# EAGLE design STM32L010F4P6 (EAGLE 9.6.0)
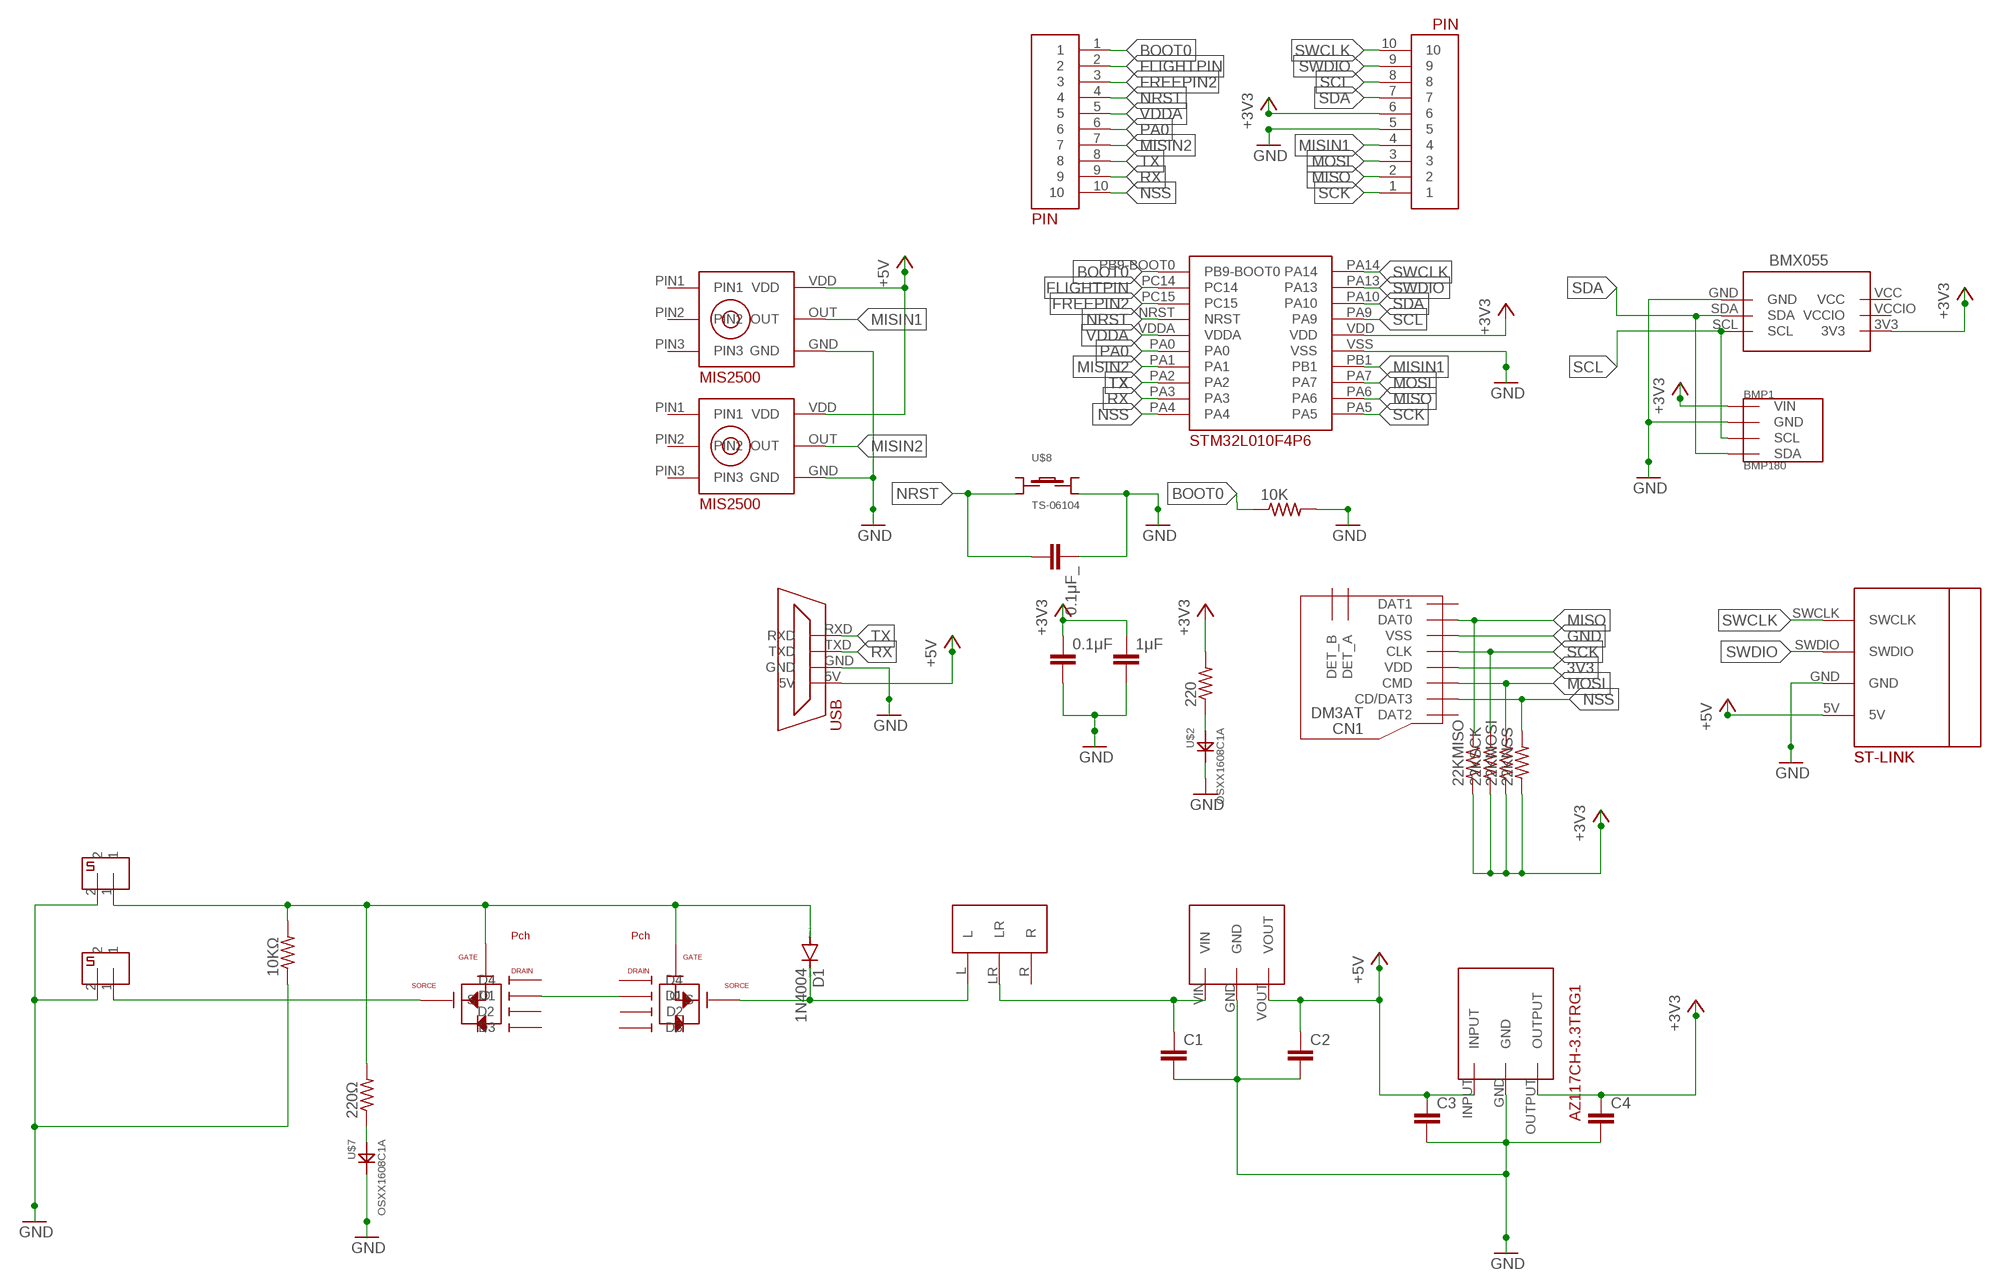
[diagram p0: schematic, sheet 1]

## Parts
0.1μF  C-EUC0603  [C0603]
0.1μF_  C-EUC0603  [C0603]
1μF  C-EUC0805  [C0805]
10K  R-US_R0603  [R0603]
10KΩ  R-US_R0603  [R0603]
22KMISO  R-US_R0603  [R0603]
22KMOSI  R-US_R0603  [R0603]
22KNSS  R-US_R0603  [R0603]
22KSCK  R-US_R0603  [R0603]
220  R-US_R0603  [R0603]
220Ω  R-US_R0603  [R0603]
BMP1  BMP180  [GY-68]
BMX1  BMX055  [BMX055]
C1  C2,5-3  [C2.5-3]
C2  C2,5-3  [C2.5-3]
C3  C2,5-3  [C2.5-3]
C4  C2,5-3  [C2.5-3]
CN1  DM3AT  [DM3AT]
CONNECTOR1  2PIN  [2PIN]
CONNECTOR3  2PIN  [2PIN]
D1  1N4004  [DO41-10]
SRIDE_SWTCH1  SRIDE_SWITCH  [SRIDE_SWITCH]
U$1  STM32L010F4P6  [STM32L010F4P6]
U$2  OSXX1608C1A  [OSXX1608C1A]
U$3  MIS2500  [MIS2500]
U$4  MIS2500  [MIS2500]
U$5  STLINK  [STLINK]
U$6  SSM6J808R  [SSM6J808R]
U$7  OSXX1608C1A  [OSXX1608C1A]
U$8  TS-06104  [TS-06104]
U$9  SSM6J808R  [SSM6J808R]
U$11  M78AR05-1  [M78AR05-1]
U$12  10PIN  [10PIN]
U$13  10PIN  [10PIN]
U$14  F234X  [FT234X]
U$17  AZ117CH-3.3TRG1  [AZ117CH-3.3TRG1]

## Nets
3V3: CN1.VDD
+3V3: 0.1μF.1 1μF.1 22KMISO.1 22KMOSI.1 22KNSS.1 22KSCK.1 220.2 BMP1.P1(VIN) BMX1.3V3 C4.1 U$1.VDD U$13.6 U$17.OUTPUT
+5V: C2.1 C3.1 U$3.VDD U$4.VDD U$5.5V U$11.VOUT U$14.5V U$17.INPUT
BOOT0: 10K.1 U$1.PB9-BOOT0 U$12.1
EXIN: 10KΩ.2 220Ω.2 CONNECTOR1.1 D1.A U$6.G U$9.G
FLIGHTPIN: U$1.PC14 U$12.2
FREEPIN2: U$1.PC15 U$12.3
GND: 0.1μF.2 0.1μF_.1 1μF.2 10K.2 10KΩ.1 BMP1.P2(GND) BMX1.GND C1.2 C2.2 C3.2 C4.2 CN1.VSS CONNECTOR1.2 CONNECTOR3.2 U$1.VSS U$2.CT U$3.GND U$4.GND U$5.GND U$7.CT U$8.D U$11.GND U$13.5 U$14.GND U$17.GND
MISIN1: U$1.PB1 U$3.OUT U$13.4
MISIN2: U$1.PA1 U$4.OUT U$12.7
MISO: 22KMISO.2 CN1.DAT0 U$1.PA6 U$13.2
MOSI: 22KMOSI.2 CN1.CMD U$1.PA7 U$13.3
N$1: U$6.D1 U$9.D1
N$2: BMP1.P4(SDA)
N$3: D1.C SRIDE_SWTCH1.L U$9.S
N$4: CONNECTOR3.1 U$6.S
N$5: C1.1 SRIDE_SWTCH1.LR U$11.VIN
N$6: 220.1 U$2.AN
N$7: 220Ω.1 U$7.AN
NRST: 0.1μF_.2 U$1.NRST U$8.B U$12.4
NSS: 22KNSS.2 CN1.CD/DAT3 U$1.PA4 U$12.10
PA0: U$1.PA0 U$12.6
RX: U$1.PA3 U$12.9 U$14.TXD
SCK: 22KSCK.2 CN1.CLK U$1.PA5 U$13.1
SCL: BMP1.P3(SCL) BMX1.SCL U$1.PA9 U$13.8
SDA: BMX1.SDA U$1.PA10 U$13.7
SWCLK: U$1.PA14 U$5.SWCLK U$13.10
SWDIO: U$1.PA13 U$5.SWDIO U$13.9
TX: U$1.PA2 U$12.8 U$14.RXD
VDDA: U$1.VDDA U$12.5
Unconnected: CN1.DAT1 CN1.DAT2 CN1.DET_A CN1.DET_B SRIDE_SWTCH1.R U$3.PIN1 U$3.PIN2 U$3.PIN3 U$4.PIN1 U$4.PIN2 U$4.PIN3 U$6.D2 U$6.D3 U$6.D4 U$8.A U$8.C U$9.D2 U$9.D3 U$9.D4

## Power pins joined to a net without a drawn wire
VCC: BMX1.VCC
VCCIO: BMX1.VCCIO

## Library data of the parts
0.1μF 0.1μF_ 1μF = rcl:C-EU: CAPACITOR, European symbol; SPICEPREFIX: C
10K 10KΩ 22KMISO 22KMOSI 22KNSS 22KSCK 220 220Ω = rcl:R-US_: RESISTOR, American symbol; SPICEPREFIX: R
BMP1 = BMP180:BMP180
BMX1 = BMX055:BMX055
C1-C4 = capacitor-wima:C: CAPACITOR naming: grid - package width
CN1 = microSD:DM3AT
CONNECTOR1 CONNECTOR3 = 2pin_small:2PIN: 2pin
D1 = diode:1N4004: DIODE general purpose rectifier, 1 A
SRIDE_SWTCH1 = Switches:SRIDE_SWITCH
U$1 = STM32L010F4P6:STM32L010F4P6
U$2 U$7 = ChipLED:OSXX1608C1A
U$3 U$4 = MIS2500:MIS2500
U$5 = ST-link:STLINK
U$6 U$9 = SSM6J808R:SSM6J808R
U$8 = Switches:TS-06104
U$11 = M78AR05-1:M78AR05-1
U$12 U$13 = 10PIN:10PIN
U$14 = FT234X:F234X
U$17 = AZ117CH-3.3TRG1:AZ117CH-3.3TRG1

## Board
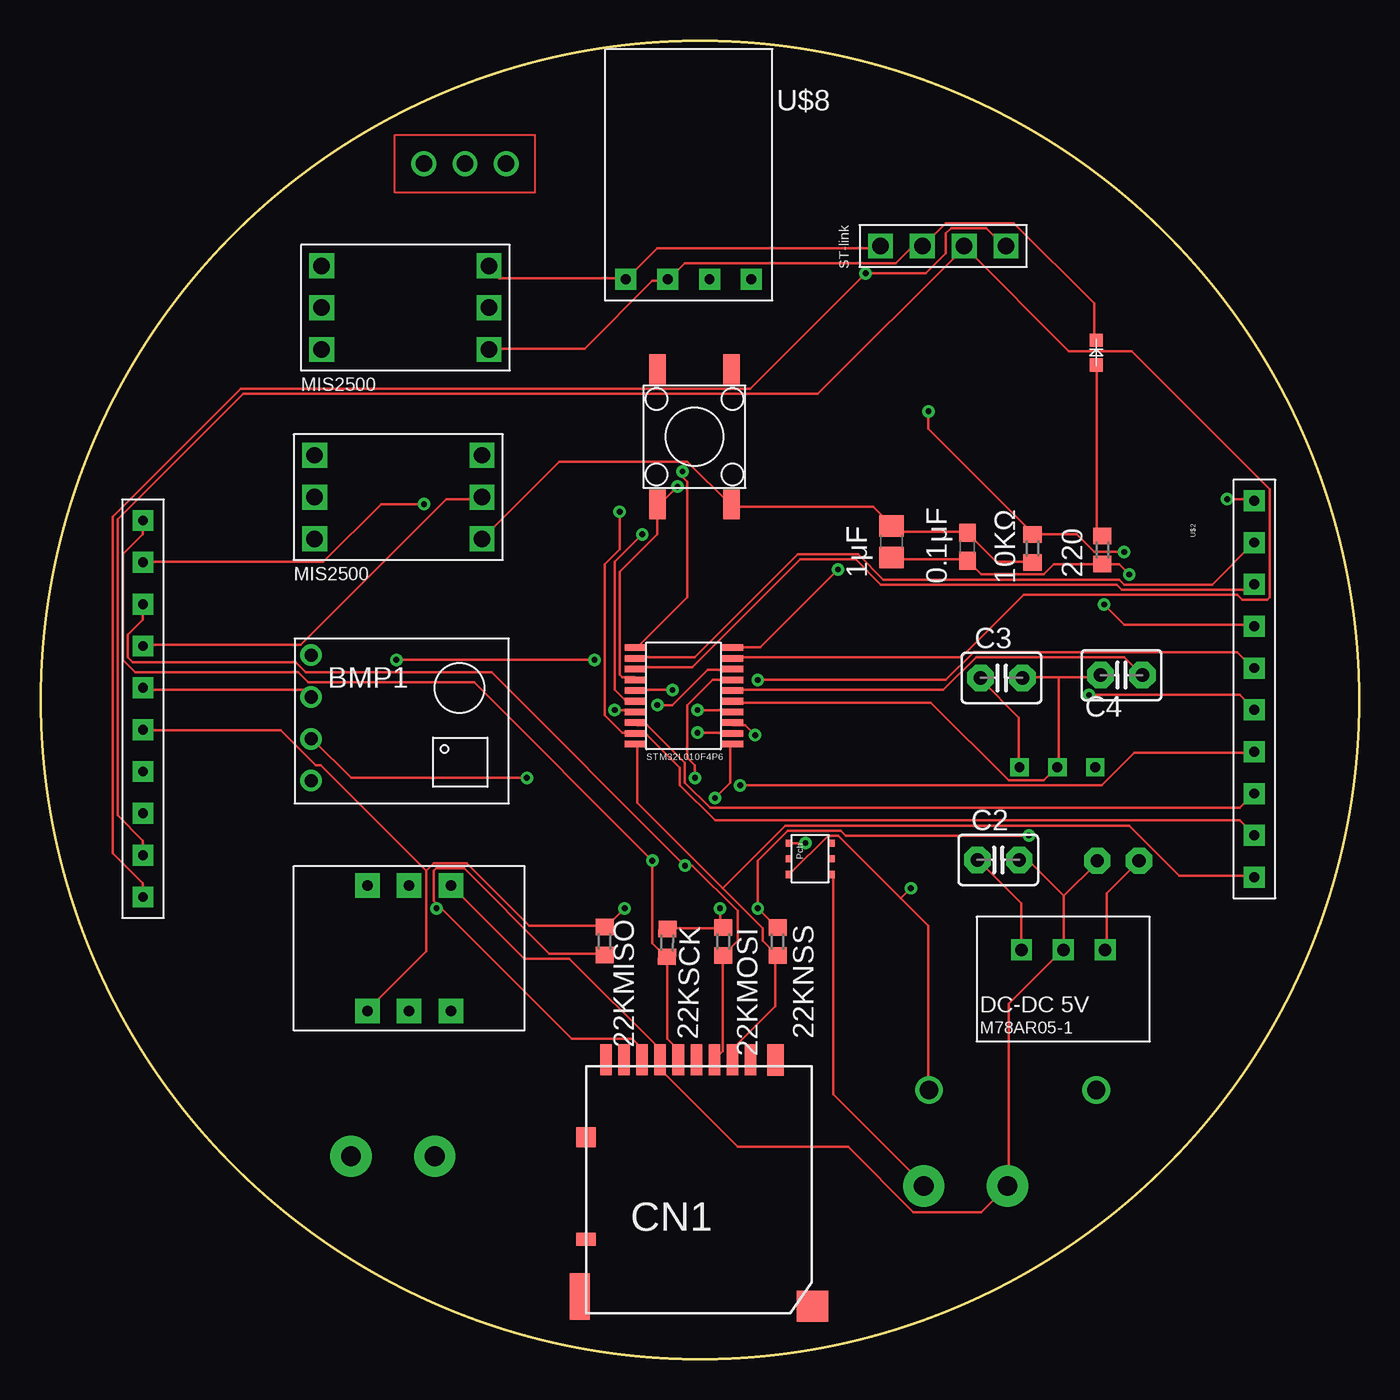
[diagram p1: board, top side]
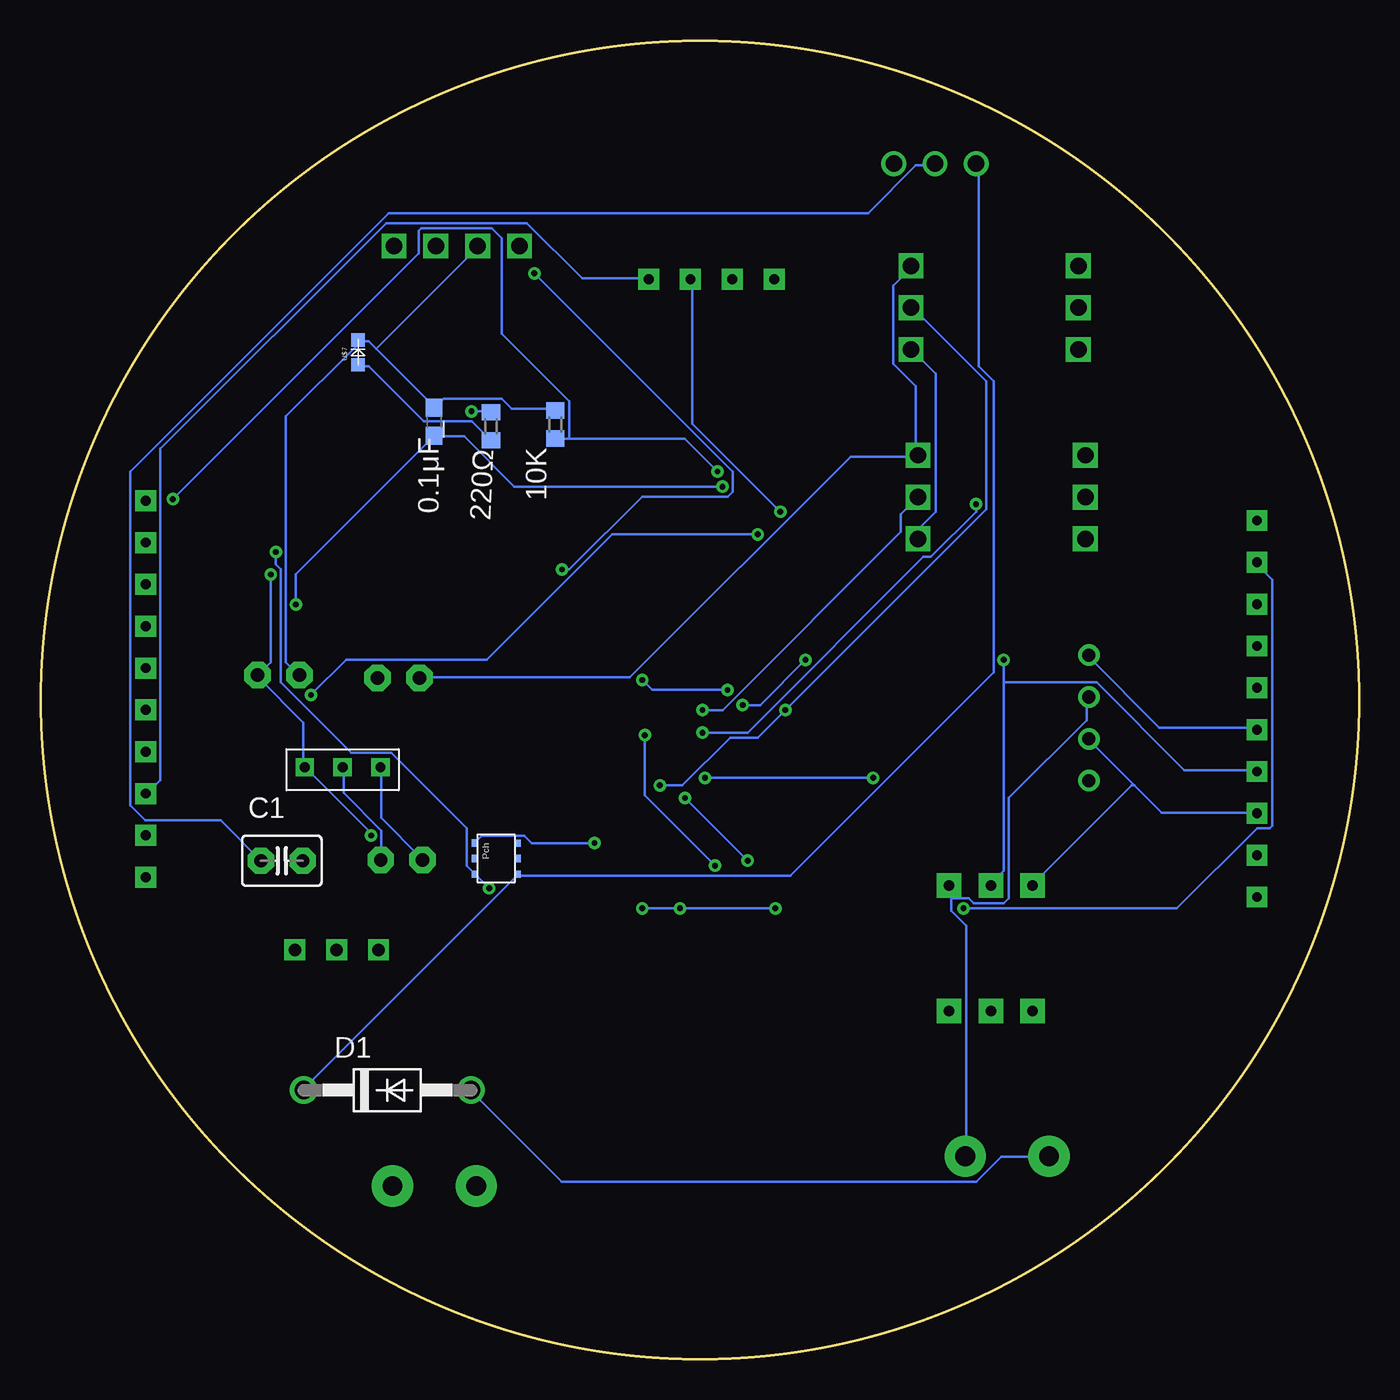
[diagram p2: board, bottom side, seen from below]

Size 80 x 80 mm. Coordinates in mm from the lower left corner, seen from the top.
Outline: circle at 40,40 radius 40
Copper layers (1*16): Top 0.035mm / dielectric 1.5mm / Bottom 0.035mm
Design rules "default": minimum track width 6mil, minimum drill 0.35mm, track to track 6mil, track to pad 6mil, pad to pad 6mil, via to via 6mil, smd to smd 6mil, copper to edge 40mil, drill to drill 6mil, minimum pad ring 10mil, minimum via ring 8mil, stop-mask expansion 4mil, vias tented up to drill 0mil, thermal gap 10mil

### Footprints (pad centres in the part's own frame; a part is rotated, then mirrored left to right if it is on the bottom)
C0603 = smd 1.1 x 1: 1 -0.85,0; 2 0.85,0
C0805 = smd 1.3 x 1.5: 1 -0.95,0; 2 0.95,0
R0603 = smd 1 x 1.1: 1 -0.85,0; 2 0.85,0
GY-68 = drill 0.8: P1 -5,4; P2 -5,1.46; P3 -5,-1.08; P4 -5,-3.62
BMX055 = drill 0.65 pad 1.5 square: 3V3 8.81,-9.53; GND 1.19,-4.46; SCL 1.19,-9.53; SDA 1.19,-7; VCC 8.81,-4.46; VCCIO 8.81,-7
C2.5-3 = drill 0.813 pad 1.6 octagon: 1 -1.27,0; 2 1.27,0
DM3AT = smd 0.7 x 1.9: CD/DAT3 2.2,6.4; CLK -1.1,6.4; CMD 1.1,6.4; DAT0 -3.3,6.4; DAT1 -4.4,6.4; DAT2 3.3,6.4; DET_B -5.5,6.4; VDD 0,6.4; VSS -2.2,6.4 | smd 1.2 x 0.8: DET_A -6.7,-4.5 | smd 1 x 1.9: P$9 4.8,6.381 | smd 1.2 x 1.2: P$11 -6.7,1.7 | smd 1.2 x 2.8: P$13 -7.081,-7.973 | smd 1.9 x 1.9: P$14 7.054,-8.562
2PIN = drill 1.2 pad 2.5: 1 0,0; 2 5.08,0
DO41-10 = drill 1.118: A 5.08,0; C -5.08,0
SRIDE_SWITCH = drill 1: L -2.5,0; LR 0,0; R 2.5,0
STM32L010F4P6 = smd 1.35 x 0.4: NRST -0.65,4.225; PA0 -0.65,2.925; PA1 -0.65,2.275; PA2 -0.65,1.625; PA3 -0.65,0.975; PA4 -0.65,0.325; PA5 5.2,0.325; PA6 5.2,0.975; PA7 5.2,1.625; PA9 5.2,4.225; PA10 5.2,4.875; PA13 5.2,5.525; PA14 5.2,6.175; PB1 5.2,2.275; PB9-BOOT0 -0.65,6.175; PC14 -0.65,5.525; PC15 -0.65,4.875; VDD 5.2,3.575; VDDA -0.65,3.575; VSS 5.2,2.925
OSXX1608C1A = smd 0.8 x 0.8: AN -0.75,0; CT 0.75,0
MIS2500 = drill 1 square: GND 10.16,1.27; OUT 10.16,3.81; PIN1 0,6.35; PIN2 0,3.81; PIN3 0,1.27; VDD 10.16,6.35
STLINK = drill 1 square: 5V 2.54,0; GND 2.54,2.54; SWCLK 2.54,7.62; SWDIO 2.54,5.08
SSM6J808R = smd 0.44 x 0.33: D1 0,0; D2 0.95,0; D3 0.01,2.64; D4 0.95,2.64; G 1.9,0; S 1.9,2.64
TS-06104 = smd 1 x 1.8: A -2.25,4.1; B -2.25,-4.1; C 2.25,4.1; D 2.25,-4.1
M78AR05-1 = drill 0.75 pad 1.27 square: GND 0,0; VIN 2.54,0; VOUT -2.54,0
10PIN = drill 0.6 pad 1.27 square: 1 2.54,22.86; 2 2.54,20.32; 3 2.54,17.78; 4 2.54,15.24; 5 2.54,12.7; 6 2.54,10.16; 7 2.54,7.62; 8 2.54,5.08; 9 2.54,2.54; 10 2.54,0
FT234X = drill 0.6 pad 1.27 square: 5V 0,1.27; GND 2.54,1.27; RXD 7.62,1.27; TXD 5.08,1.27
AZ117CH-3.3TRG1 = drill 0.6 square: GND -1.1,-3.4; INPUT -1.1,-5.7; OUTPUT -1.1,-1.1

### Placement (x,y rotation side)
0.1μF  56.24,49.31 90 top
0.1μF_  56.15,56.89 270 bottom
1μF  51.63,49.61 90 top
10K  48.79,56.72 90 bottom
10KΩ  60.19,49.21 90 top
22KMISO  34.21,25.36 270 top
22KMOSI  41.41,25.34 270 top
22KNSS  44.71,25.33 270 top
22KSCK  38.01,25.25 268.9 top
220  64.43,49.11 270 top
220Ω  52.69,56.62 90 bottom
BMP1  21.39,38.72 0 top
BMX1  29.34,29.93 270 top
C1  65.39,30.24 0 bottom
C2  58.11,30.29 0 top
C3  58.31,41.34 0 top
C4  65.59,41.51 180 top
CN1  39.78,11.76 0 top
CONNECTOR1  18.81,12.3 0 top
CONNECTOR3  53.59,10.49 0 top
D1  58.98,16.31 0 bottom
SRIDE_SWTCH1  25.73,72.56 0 top
U$1  36.75,37 0 top
U$2  64.05,61.09 90 top
U$3  16.6,48.51 0 top
U$4  17.03,60.01 0 top
U$5  50.96,70.1 270 top
U$6  45.38,31.31 270 top
U$7  60.76,61.11 90 bottom
U$8  39.66,55.98 0 top
U$9  53.68,31.32 270 bottom
U$11  62.06,24.83 0 top
U$12  71.12,29.24 0 top
U$13  3.64,28.04 0 top
U$14  35.5,64.27 0 top
U$17  65.1,37.01 90 bottom

### Tracks (layer width: path | path; a pad name or v marks a point on that pad's centre or on a via)
+3V3  (via drill 0.35)
  Top 0.152: 1μF.1 51.73,48.53 56.15,48.53 0.1μF.1 56.31,48.38 57.07,47.62 60.88,47.62 61.49,48.23 64.38,48.23 220.2 64.54,48.23 65.45,48.23 v66.06,47.62 | U$1.VDD 41.98,40.61 54.78,40.61 56.76,42.59 65.76,42.59 66.82,41.52 C4.1 | 41.22,26.13 41.37,26.13 22KMOSI.1 41.22,26.13 | 41.22,26.13 38.17,26.13 22KSCK.1 | 41.22,26.13 v41.22,27.35 | 22KNSS.1 44.57,26.28 v43.51,27.35 43.51,30.25 45.33,32.08 48.53,32.08 48.84,31.77 v59.96,31.77 | 23.39,29.64 23.85,30.09 25.83,30.09 29.64,26.28 34.21,26.28 22KMISO.1 34.36,26.28 v35.43,27.35 | 23.39,29.64 23.39,24.76 19.88,21.25 BMX1.3V3 | 23.39,29.64 16.99,36.04 16.68,36.04 14.55,38.17 6.32,38.17 U$13.6
  Bottom 0.152: v66.06,47.62 66.06,42.29 66.82,41.52 C4.1 66.82,41.37 64.08,38.63 64.08,36.04 U$17.OUTPUT 63.93,35.88 59.96,31.92 v59.96,31.77 | U$13.6 6.32,38.32 12.11,38.32 16.38,42.59 BMP1.P1 | v43.51,27.35 v41.22,27.35 v35.43,27.35
+5V
  Top 0.152: U$17.INPUT 59.36,36.04 59.36,38.93 57.07,41.22 C3.1 | U$11.VOUT 59.51,24.91 59.51,27.66 56.92,30.25 C2.1 | U$4.VDD 27.2,66.21 27.81,65.6 35.43,65.6 U$14.5V 35.58,65.6 37.41,67.43 50.82,67.43 U$5.5V
  Bottom 0.152: U$17.INPUT 59.36,35.88 59.36,32.84 56.92,30.4 C2.1 | U$4.VDD 27.2,66.21 28.27,65.15 28.27,60.42 26.89,59.05 26.89,54.94 U$3.VDD 26.89,54.78 30.86,54.78 44.27,41.37 56.92,41.37 C3.1
BOOT0  (via drill 0.35)
  Top 0.152: v38.93,53.87 38.93,53.56 39.24,53.26 39.24,46.25 36.19,43.2 U$1.PB9-BOOT0 | v72,52.19 73.53,52.19 U$12.1
  Bottom 0.152: 47.92,55.85 40.91,55.85 v38.93,53.87 | 47.92,55.85 48.69,55.85 10K.1 | v72,52.19 57.07,67.13 57.07,68.5 56.92,68.65 52.65,68.65 52.04,68.04 52.04,62.25 47.92,58.14 47.92,55.85
EXIN  (via drill 0.35)
  Top 0.152: v53.87,57.53 53.87,56.46 60.12,50.21 10KΩ.2 60.27,50.06 62.86,50.06 63.93,48.99 v65.76,48.99 | 52.19,27.96 53.87,26.28 53.87,16.38 D1.A | 52.19,27.96 48.38,31.77 47.77,31.77 45.49,29.48 U$6.G | 52.19,27.96 v52.8,28.57
  Bottom 0.152: v53.87,57.53 52.8,57.53 220Ω.2 | v52.8,28.57 53.56,29.33 U$9.G 53.72,29.48 54.17,29.94 54.17,32.23 58.75,36.8 61.18,36.8 65.45,41.07 65.45,47.92 65.76,48.23 v65.76,48.99 | CONNECTOR1.1 18.82,12.26 21.71,12.26 23.24,10.74 48.38,10.74 53.87,16.23 D1.A
FLIGHTPIN
  Top 0.152: U$1.PC14 36.19,42.59 39.7,42.59 45.94,48.84 49.6,48.84 51.12,47.31 65.45,47.31 65.76,47.01 71.09,47.01 73.53,49.45 U$12.2
FREEPIN2
  Top 0.152: U$1.PC15 36.19,41.98 39.54,41.98 46.1,48.53 49.45,48.53 50.97,47.01 65.3,47.01 65.6,46.71 73.22,46.71 73.53,47.01 U$12.3
GND
  Top 0.152: U$13.5 6.32,40.61 16.07,40.61 16.38,40.3 BMP1.P2 | BMX1.GND 24.91,28.72 29.33,24.3 32.08,24.3 37.56,18.82 37.56,18.21 CN1.VSS 37.71,18.05 37.71,17.45 42.29,12.87 48.99,12.87 52.95,8.91 57.07,8.91 58.59,10.43 CONNECTOR3.2 58.75,10.59 58.75,21.56 61.95,24.76 U$11.GND 62.1,24.91 62.1,28.11 | U$2.CT 63.93,61.95 63.93,64.08 59.05,68.96 54.94,68.96 53.56,67.58 U$5.GND 53.41,67.43 52.8,67.43 51.89,66.52 39.09,66.52 38.17,65.6 U$14.GND 38.02,65.45 37.1,65.45 32.99,61.34 27.2,61.34 U$4.GND | 10KΩ.1 60.12,48.38 57.98,48.38 56.31,50.06 0.1μF.2 56.15,50.21 52.04,50.21 51.73,50.52 1μF.2 51.58,50.67 50.52,51.73 41.98,51.73 U$8.D 41.83,51.89 39.24,54.48 31.47,54.48 26.89,49.91 U$3.GND | 61.79,41.37 64.23,41.37 C4.2 | 61.79,41.37 59.66,41.37 C3.2 | U$1.VSS 41.98,39.85 54.02,39.85 58.75,35.12 60.88,35.12 61.64,35.88 U$17.GND 61.79,36.04 61.79,41.37 | 62.1,28.11 64.08,30.09 C1.2 | 62.1,28.11 59.96,30.25 59.51,30.25 C2.2
  Bottom 0.152: 24.76,27.96 24.76,28.72 BMX1.GND | 24.76,27.96 24.76,27.2 23.85,26.28 23.85,12.42 CONNECTOR1.2 | 24.76,27.96 23.69,27.96 23.39,27.66 21.56,27.66 21.25,27.96 21.25,34.06 16.53,38.78 16.53,40.15 BMP1.P2 | 59.66,61.34 56.15,57.83 0.1μF_.1 56,57.83 55.55,58.29 52.04,58.29 51.43,57.68 48.84,57.68 10K.2 | 59.66,61.34 60.12,61.79 60.73,61.79 U$7.CT 60.88,61.79 60.88,61.49 65.15,57.22 65.15,42.29 64.38,41.52 C4.2 | 59.66,61.34 53.56,67.43 U$5.GND | U$3.GND 26.74,49.91 26.74,50.36 25.67,51.43 25.67,59.81 27.05,61.18 U$4.GND | U$17.GND 61.64,35.88 61.64,34.36 59.36,32.08 59.36,30.4 C2.2
MISIN1  (via drill 0.35)
  Top 0.152: v39.85,39.39 41.83,39.39 U$1.PB1 | U$13.4 6.32,43.35 15.77,43.35 24.61,52.19 26.74,52.19 U$3.OUT
  Bottom 0.152: v39.85,39.39 38.63,39.39 27.81,50.21 27.81,51.28 26.89,52.19 U$3.OUT
MISIN2  (via drill 0.35)
  Top 0.152: v34.82,39.39 36.04,39.39 U$1.PA1 | v42.44,34.82 64.38,34.82 66.36,36.8 73.53,36.8 U$12.7
  Bottom 0.152: U$4.OUT 27.05,63.77 22.63,59.36 22.63,51.58 v34.82,39.39 36.49,37.71 38.17,37.71 41.07,34.82 v42.44,34.82
MISO  (via drill 0.35)
  Top 0.152: 24.15,27.5 32.23,19.43 35.88,19.43 36.34,18.97 36.34,18.21 CN1.DAT0 | 24.15,27.5 23.85,27.81 23.85,29.64 24,29.79 25.67,29.79 30.86,24.61 34.21,24.61 22KMISO.2 | v39.85,38.02 41.83,38.02 U$1.PA6 | v23.24,51.89 20.64,51.89 17.14,48.38 6.32,48.38 U$13.2 | v24,27.35 24.15,27.5
  Bottom 0.152: v39.85,38.02 37.1,38.02 26.44,48.69 25.98,48.69 23.24,51.43 v23.24,51.89 | v24,27.35 11.04,27.35 6.17,32.23 5.41,32.23 5.25,32.38 5.25,47.31 6.17,48.23 U$13.2
MOSI  (via drill 0.35)
  Top 0.152: CN1.CMD 40.91,18.21 41.37,18.66 41.37,24.45 22KMOSI.2 41.52,24.61 42.29,25.37 42.29,27.2 39.54,29.94 v39.09,29.94 27.35,41.68 16.07,41.68 15.46,42.29 5.56,42.29 5.25,42.59 5.25,43.96 6.17,44.88 6.17,45.79 U$13.3 | v43.35,37.87 42.74,38.48 41.98,38.48 U$1.PA7
  Bottom 0.152: v43.35,37.87 43.35,34.21 v39.09,29.94
N$1  (via drill 0.35)
  Top 0.152: v46.4,31.31 45.49,31.31 U$6.D1
  Bottom 0.152: v46.4,31.31 50.21,31.31 50.67,31.77 53.26,31.77 53.56,31.47 U$9.D1
N$3
  Bottom 0.152: D1.C 64.08,16.38 51.12,29.33 U$9.S 50.97,29.33 34.51,29.33 22.17,41.68 22.17,59.36 23.08,60.27 23.08,72.46 SRIDE_SWTCH1.L
N$4
  Top 0.152: U$6.S 48.08,29.33 48.08,16.07 53.56,10.59 CONNECTOR3.1
N$5
  Top 0.152: U$11.VIN 64.69,24.91 64.69,28.27 66.52,30.09 C1.1
  Bottom 0.152: SRIDE_SWTCH1.LR 25.83,72.46 26.89,72.46 29.79,69.57 58.9,69.57 74.59,53.87 74.59,33.6 73.68,32.69 69.11,32.69 C1.1
N$6
  Top 0.152: U$2.AN 64.08,60.27 64.08,50.36 64.38,50.06 220.1
N$7
  Bottom 0.152: U$7.AN 60.73,60.27 60.12,60.27 56.76,56.92 53.87,56.92 52.8,55.85 220Ω.1
NRST  (via drill 0.35)
  Top 0.152: v38.63,52.95 37.56,51.89 U$8.B 37.41,51.73 37.41,50.06 35.12,47.77 35.12,41.52 35.28,41.37 36.04,41.37 U$1.NRST | v64.54,45.79 65.76,44.57 73.53,44.57 U$12.4
  Bottom 0.152: v38.63,52.95 51.28,52.95 54.33,56 56,56 0.1μF_.2 56.15,56 64.54,47.62 v64.54,45.79
NSS
  Top 0.152: CN1.CD/DAT3 41.98,18.21 41.98,18.82 44.57,21.41 44.57,24.45 22KNSS.2 44.57,24.61 43.81,25.37 43.81,26.13 41.37,28.57 | 41.37,28.57 36.19,33.75 36.19,37.26 U$1.PA4 | 41.37,28.57 45.18,32.38 66.06,32.38 69.11,29.33 73.53,29.33 U$12.10
PA0  (via drill 0.35)
  Top 0.152: v36.49,50.06 34.82,48.38 34.82,40.61 35.43,40 36.04,40 U$1.PA0 | v63.62,40.3 72.77,40.3 73.53,39.54 U$12.6
  Bottom 0.152: v36.49,50.06 45.33,50.06 52.95,42.44 61.49,42.44 v63.62,40.3
RX  (via drill 0.35)
  Top 0.152: U$12.9 73.53,31.92 72.77,32.69 40.91,32.69 38.78,34.82 38.78,35.88 36.8,37.87 36.19,37.87 U$1.PA3 36.04,38.02 35.28,38.02 34.21,39.09 34.21,48.23 35.12,49.14 v35.12,51.43
  Bottom 0.152: v35.12,51.43 40.46,56.76 40.46,65.45 U$14.TXD
SCK  (via drill 0.35)
  Top 0.152: CN1.CLK 38.63,18.21 38.63,18.82 38.02,19.43 38.02,24.3 22KSCK.2 37.87,24.45 37.1,25.22 v37.1,30.25 26.28,41.07 16.23,41.07 15.62,41.68 5.71,41.68 4.95,42.44 4.95,48.84 6.17,50.06 6.17,50.82 U$13.1 | v40.91,34.06 41.83,34.97 41.83,37.26 U$1.PA5
  Bottom 0.152: v37.1,30.25 v40.91,34.06
SCL  (via drill 0.35)
  Top 0.152: v39.7,35.28 39.7,36.04 39.24,36.49 39.24,39.7 40.76,41.22 41.83,41.22 U$1.PA9 | v29.48,35.28 18.82,35.28 16.53,37.56 BMP1.P3
  Bottom 0.152: v29.48,35.28 v39.7,35.28 | 13.64,34.82 16.38,37.56 BMP1.P3 | 13.64,34.82 11.96,33.14 6.32,33.14 U$13.8 | 13.64,34.82 13.79,34.82 19.73,28.88 BMX1.SCL
SDA  (via drill 0.35)
  Top 0.152: v37.41,39.7 38.32,39.7 40.46,41.83 41.83,41.83 U$1.PA10 | v21.56,42.44 v33.6,42.44
  Bottom 0.152: v37.41,39.7 36.34,39.7 v33.6,42.44 | 21.56,41.07 21.56,29.64 22.32,28.88 BMX1.SDA | 21.56,41.07 v21.56,42.44 | 21.56,41.07 15.92,41.07 10.59,35.73 6.32,35.73 U$13.7
SWCLK  (via drill 0.35)
  Top 0.152: v48.38,47.92 43.66,43.2 41.98,43.2 U$1.PA14 | U$5.SWCLK 58.44,67.58 57.37,68.65 55.24,68.65 54.94,68.35 54.94,67.13 53.72,65.91 v50.06,65.91 43.05,58.9 12.11,58.9 4.34,51.12 4.34,30.7 6.17,28.88 6.17,28.11 U$13.10
  Bottom 0.152: v48.38,47.92 47.92,47.92 43.51,52.34 38.32,52.34 38.02,52.65 38.02,53.87 v50.06,65.91
SWDIO
  Top 0.152: U$1.PA13 41.98,42.59 55.85,42.59 59.66,46.4 72.61,46.4 72.92,46.1 74.44,46.1 74.59,46.25 74.59,52.8 66.21,61.18 62.4,61.18 56.15,67.43 U$5.SWDIO 56,67.43 47.16,58.59 12.26,58.59 4.64,50.97 4.64,32.99 6.17,31.47 6.17,30.7 U$13.9
TX
  Top 0.152: U$1.PA2 36.19,38.48 36.8,38.48 39.09,36.19 39.09,34.97 40.61,33.45 72.77,33.45 73.53,34.21 U$12.8
  Bottom 0.152: U$14.RXD 43.2,65.6 47.16,65.6 50.52,68.96 59.05,68.96 72.77,55.24 72.77,35.12 73.53,34.36 U$12.8
VDDA  (via drill 0.35)
  Top 0.152: v38.32,40.61 36.19,40.61 U$1.VDDA | v43.51,41.22 54.94,41.22 56.61,42.9 72.61,42.9 73.53,41.98 U$12.5
  Bottom 0.152: v38.32,40.61 42.9,40.61 v43.51,41.22